# EAGLE design StabTracker (EAGLE 7.5.0)

## Sheet 1 of 3
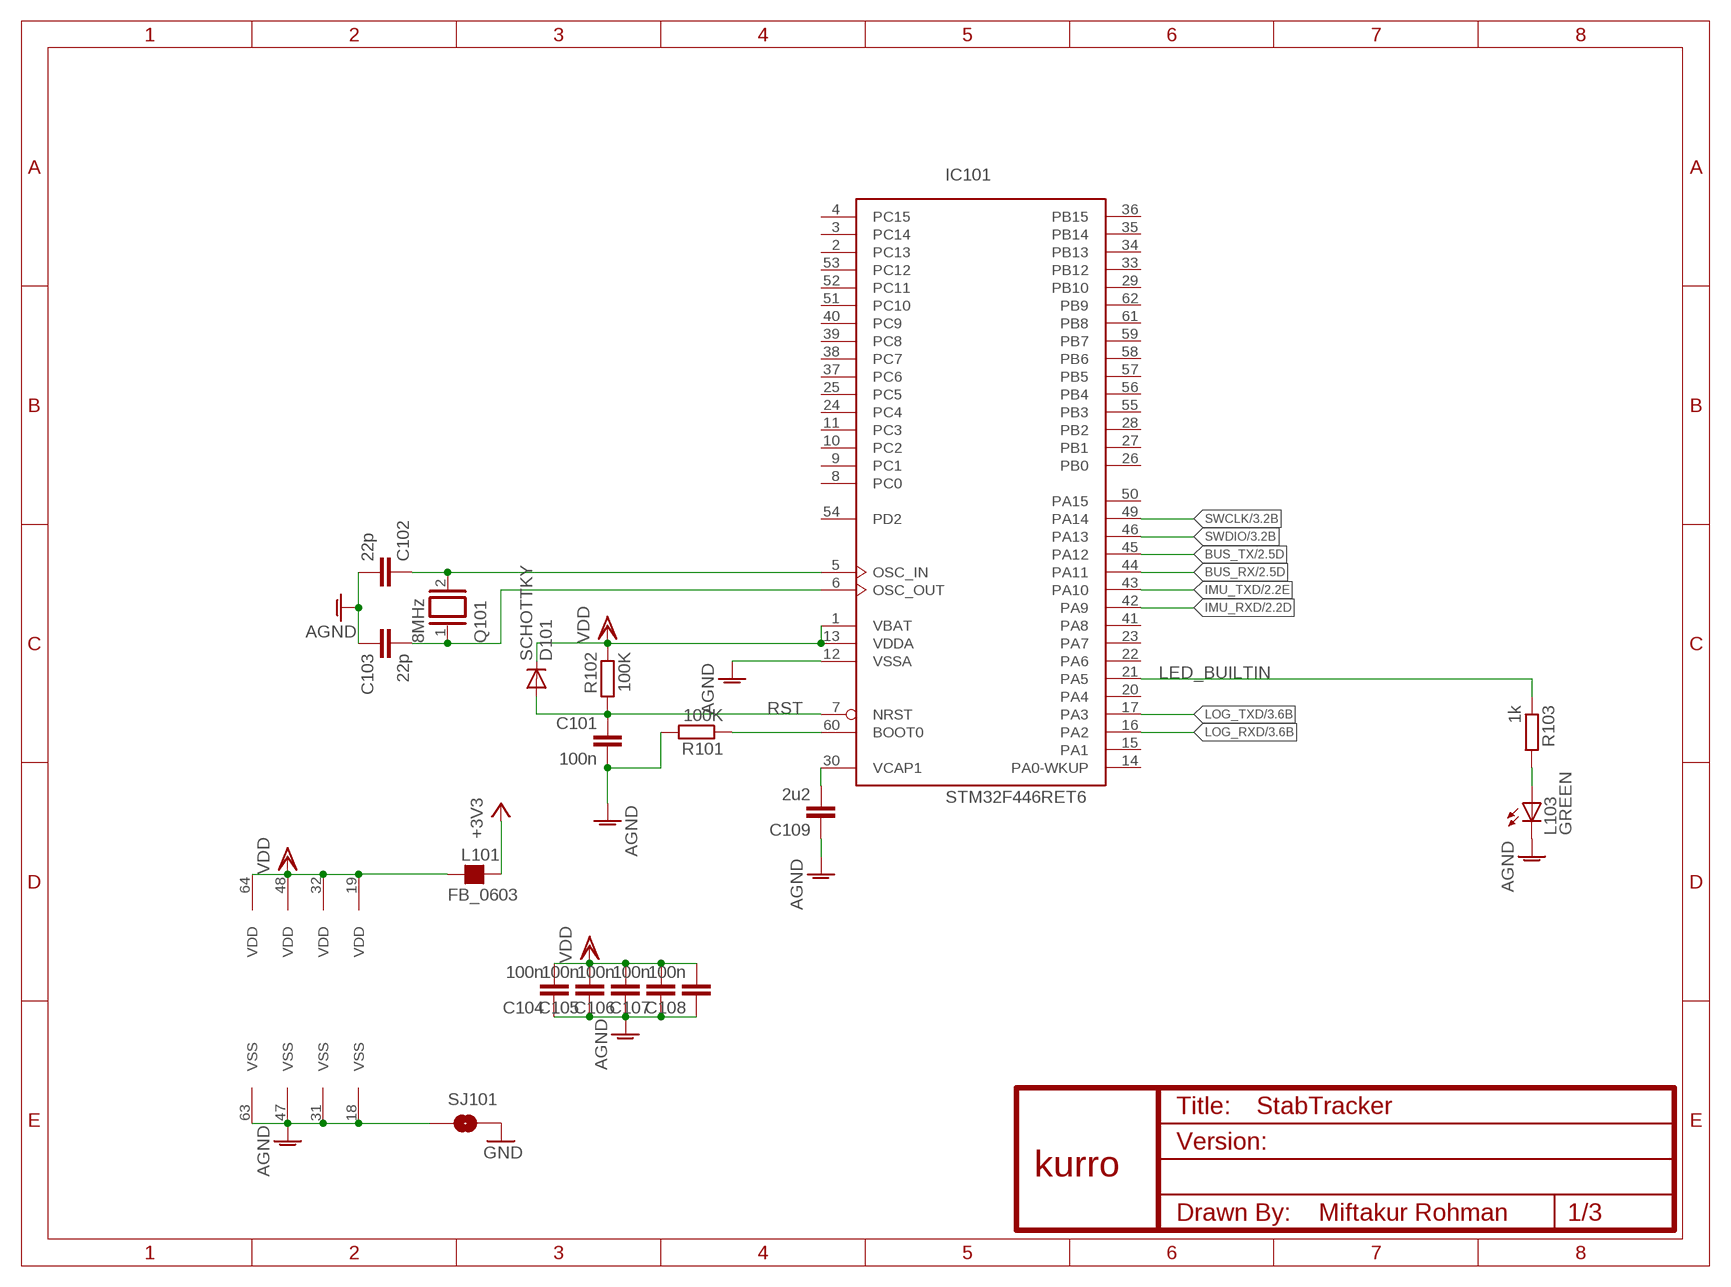
[diagram p0: schematic, sheet 1]

### Parts
C101  100n  C-EUC0603  [C0603]
C102  22p  C-EUC0603  [C0603]
C103  22p  C-EUC0603  [C0603]
C104  100n  C-EUC0603  [C0603]
C105  100n  C-EUC0603  [C0603]
C106  100n  C-EUC0603  [C0603]
C107  100n  C-EUC0603  [C0603]
C108  100n  C-EUC0603  [C0603]
C109  2u2  C-EUC0603  [C0603]
D101  SCHOTTKY  DIODE-MICROMELF-W  [MICROMELF-W]
IC101  STM32F446RET6  STM32F401RBT  [LQFP64]
L101  FB_0603  [L0603]
L103  GREEN  LEDCHIP-LED0805  [CHIP-LED0805]
Q101  8MHz  XTAL/S  [QS]
R101  100K  R-EU_R0603  [R0603]
R102  100K  R-EU_R0603  [R0603]
R103  1k  R-EU_R0603  [R0603]
SJ101  SOLDERJUMPERTRACE  [SJ_2S-TRACE]
U$1  KURRO_FOOTPRINT  [KURRO-LOGO]

### Nets
+3V3: L101.2 ; also sheet 2,3
AGND: C101.2 C102.2 C103.1 C104.1 C105.1 C106.1 C107.1 C108.1 C109.1 IC101.12(VSSA) IC101.18(VSS) IC101.31(VSS) IC101.47(VSS) IC101.63(VSS) L103.C R101.2 SJ101.1 ; also sheet 3
BOOT0: IC101.60(BOOT0) R101.1
BUS_RX: IC101.44(PA11) ; also sheet 2
BUS_TX: IC101.45(PA12) ; also sheet 2
GND: SJ101.2 ; also sheet 2,3
IMU_RXD: IC101.42(PA9) ; also sheet 2
IMU_TXD: IC101.43(PA10) ; also sheet 2
LED_BUILTIN: IC101.21(PA5) R103.1
LOG_RXD: IC101.16(PA2) ; also sheet 3
LOG_TXD: IC101.17(PA3) ; also sheet 3
N$1: C103.2 IC101.6(OSC_OUT) Q101.1
N$2: C102.1 IC101.5(OSC_IN) Q101.2
N$4: C109.2 IC101.30(VCAP1)
N$5: L103.A R103.2
RST: C101.1 D101.A IC101.7(NRST) R102.2
SWCLK: IC101.49(PA14) ; also sheet 3
SWDIO: IC101.46(PA13) ; also sheet 3
VDD: C104.2 C105.2 C106.2 C107.2 C108.2 D101.C IC101.1(VBAT) IC101.13(VDDA) IC101.19(VDD) IC101.32(VDD) IC101.48(VDD) IC101.64(VDD) L101.1 R102.1
Unconnected: IC101.2(PC13) IC101.3(PC14) IC101.4(PC15) IC101.8(PC0) IC101.9(PC1) IC101.10(PC2) IC101.11(PC3) IC101.14(PA0-WKUP) IC101.15(PA1) IC101.20(PA4) IC101.22(PA6) IC101.23(PA7) IC101.24(PC4) IC101.25(PC5) IC101.26(PB0) IC101.27(PB1) IC101.28(PB2) IC101.29(PB10) IC101.33(PB12) IC101.34(PB13) IC101.35(PB14) IC101.36(PB15) IC101.37(PC6) IC101.38(PC7) IC101.39(PC8) IC101.40(PC9) IC101.41(PA8) IC101.50(PA15) IC101.51(PC10) IC101.52(PC11) IC101.53(PC12) IC101.54(PD2) IC101.55(PB3) IC101.56(PB4) IC101.57(PB5) IC101.58(PB6) IC101.59(PB7) IC101.61(PB8) IC101.62(PB9)

## Sheet 2 of 3
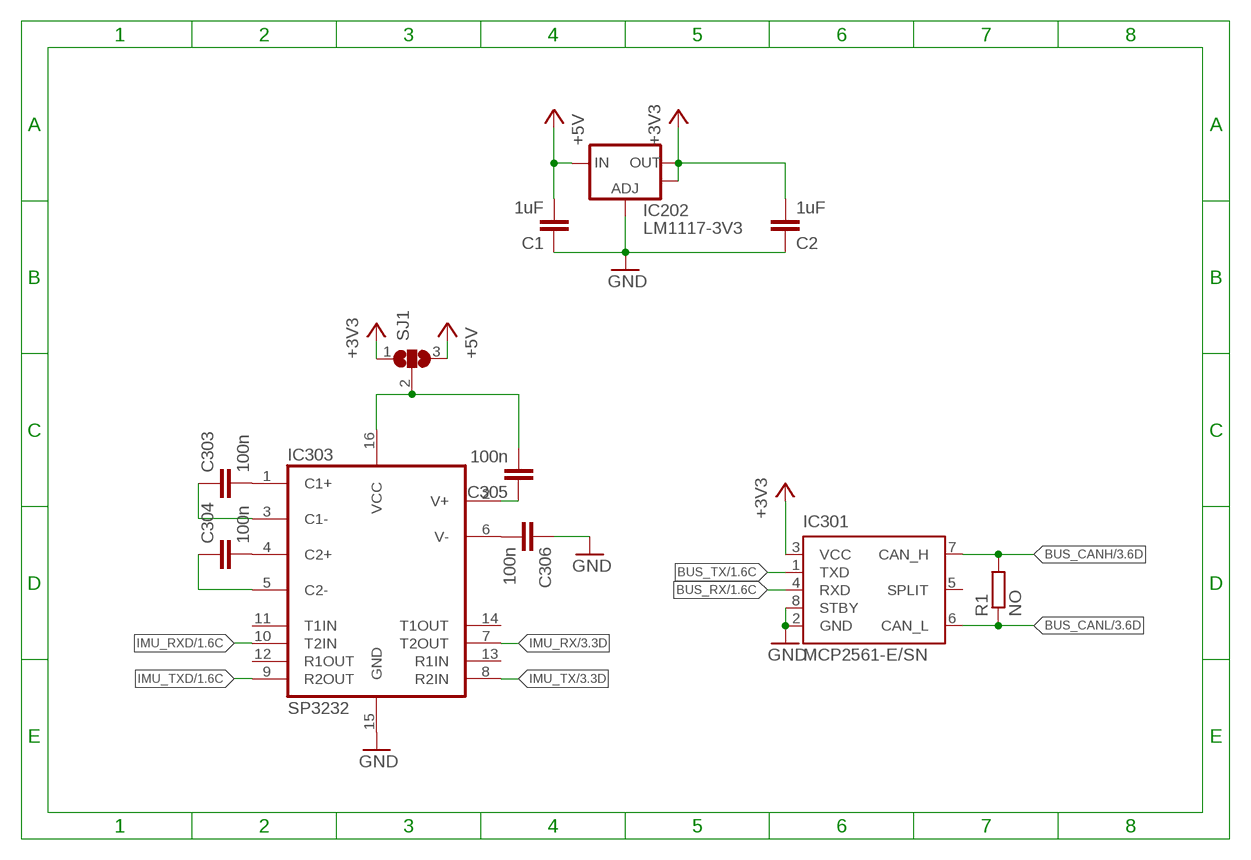
[diagram p1: schematic, sheet 2]

### Parts
C1  1uF  C-EUC0603  [C0603]
C2  1uF  C-EUC0603  [C0603]
C303  100n  C-EUC0603  [C0603]
C304  100n  C-EUC0603  [C0603]
C305  100n  C-EUC0603  [C0603]
C306  100n  C-EUC0603  [C0603]
IC202  LM1117-3V3  V_REG_LM1117SOT223  [SOT223]
IC301  MCP2561-E/SN  [SOIC-8]
IC303  SP3232  MAX232SOIC16  [SO016]
R1  NO  R-EU_R0603  [R0603]
SJ1  SJ2W-TRACE  [SJ2]

### Nets
+3V3: C2.2 IC202.2(OUT) IC202.4(OUT) IC301.3(VCC) SJ1.1 ; also sheet 1,3
+5V: C1.2 IC202.3(IN) SJ1.3 ; also sheet 3
BUS_CANH: IC301.7(CAN_H) R1.2 ; also sheet 3
BUS_CANL: IC301.6(CAN_L) R1.1 ; also sheet 3
BUS_RX: IC301.4(RXD) ; also sheet 1
BUS_TX: IC301.1(TXD) ; also sheet 1
GND: C1.1 C2.1 C306.1 IC202.1(ADJ) IC301.2(GND) IC301.8(STBY) IC303.15(GND) ; also sheet 1,3
IMU_RX: IC303.7(T2OUT) ; also sheet 3
IMU_RXD: IC303.10(T2IN) ; also sheet 1
IMU_TX: IC303.8(R2IN) ; also sheet 3
IMU_TXD: IC303.9(R2OUT) ; also sheet 1
N$7: C305.2 IC303.16(VCC) SJ1.2
N$31: C306.2 IC303.6(V-)
N$32: C303.2 IC303.1(C1+)
N$33: C304.2 IC303.4(C2+)
N$68: C303.1 IC303.3(C1-)
N$69: C304.1 IC303.5(C2-)
N$72: C305.1 IC303.2(V+)
Unconnected: IC301.5(SPLIT) IC303.11(T1IN) IC303.12(R1OUT) IC303.13(R1IN) IC303.14(T1OUT)

## Sheet 3 of 3
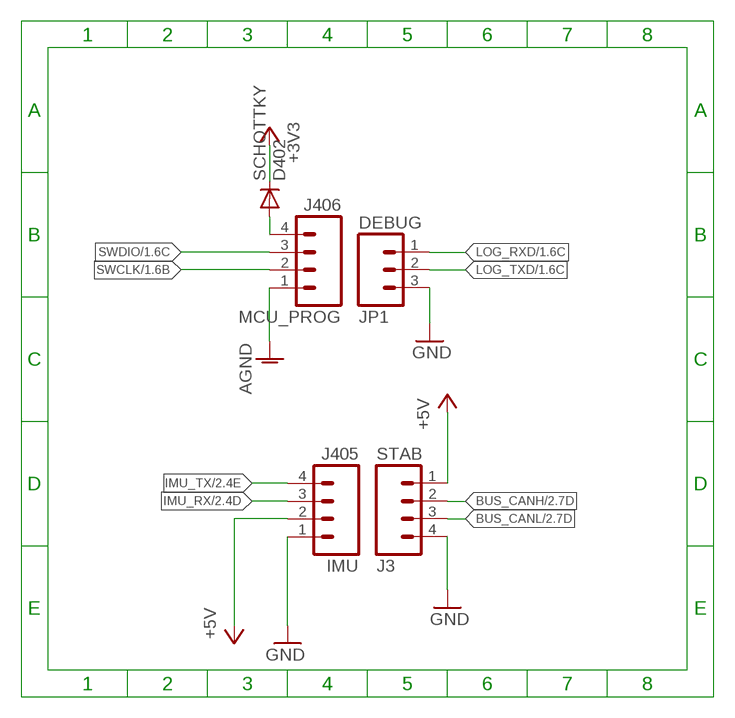
[diagram p2: schematic, sheet 3]

### Parts
D402  SCHOTTKY  DIODE-MICROMELF-W  [MICROMELF-W]
J3  STAB  M04-XH-RA  [XH-4-RA]
J405  IMU  M04-XH-RA  [XH-4-RA]
J406  MCU_PROG  M04-XH-RA  [XH-4-RA]
JP1  DEBUG  M03-XH-RA  [XH-3-RA]

### Nets
+3V3: D402.C ; also sheet 1,2
+5V: J3.1 J405.2 ; also sheet 2
AGND: J406.1 ; also sheet 1
BUS_CANH: J3.2 ; also sheet 2
BUS_CANL: J3.3 ; also sheet 2
GND: J3.4 J405.1 JP1.3 ; also sheet 1,2
IMU_RX: J405.3 ; also sheet 2
IMU_TX: J405.4 ; also sheet 2
LOG_RXD: JP1.1 ; also sheet 1
LOG_TXD: JP1.2 ; also sheet 1
N$3: D402.A J406.4
SWCLK: J406.2 ; also sheet 1
SWDIO: J406.3 ; also sheet 1

## Library data of the parts
C1 C2 C101-C109 C303-C306 = resistor:C-EU: CAPACITOR, European symbol
D101 D402 = diode:DIODE-: DIODE
IC101 = micro-stm_v3:STM32F401R*T: ARM 32-bit Cortex™-M3 CPU 84 MHz maximum frequency 128 to 256 Kbytes of Flash memory 64 kbytes of SRAM 50 GPIOs 1.7 to 3.6 V application supply
IC202 = SparkFun:V_REG_LM1117: Voltage Regulator LM1117 Standard adjustable voltage regulator but in SMD form. Spark Fun Electronics SKU : COM-00595
IC301 = microchip:MCP256*
IC303 = SparkFun-DigitalIC:MAX232: RS232 Transceiver Very common IC. This is generically called 'MAX232', but works with the 3V equivalent MAX3232 generic ICs. Field tested and mother approved. Spark Fun Electronics SKU : COM-00316 (DIP) and COM-00589 (SMD); PROD_ID: IC-08171
J3 J405 J406 = SparkFun-Connectors:M04: Header 4 Standard 4-pin 0.1" header. Use with straight break away headers (SKU : PRT-00116), right angle break away headers (PRT-00553), swiss pins (PRT-00743), machine pins (PRT-00117), and female headers (PRT-00115). Molex polarized connector foot print use with SKU : PRT-08231 with associated crimp pins and housings. 1MM SMD Version SKU: PRT-10208
JP1 = SparkFun-Connectors:M03: Header 3 Standard 3-pin 0.1" header. Use with straight break away headers (SKU : PRT-00116), right angle break away headers (PRT-00553), swiss pins (PRT-00743), machine pins (PRT-00117), and female headers (PRT-00115). Molex polarized connector foot print use with SKU : PRT-08232 with associated crimp pins and housings.
L101 = rc-master:FB_: FERRITE BEAD
L103 = led:LED: LED OSRAM: - CHIPLED LG R971, LG N971, LY N971, LG Q971, LY Q971, LO R971, LY R971 LH N974, LH R974 LS Q976, LO Q976, LY Q976 LO Q996 - Hyper CHIPLED LW Q18S LB Q993, LB Q99A, LB R99A - SideLED LS A670, LO A670, LY A670, LG A670, LP A670 LB A673, LV A673, LT A673, LW A673 LH A674 LY A675 LS A676, LA A676, LO A676, LY A676, LW A676 LS A679, LY A679, LG A679 - Hyper Micro SIDELED® LS Y876, LA Y876, LO Y876, LY Y876 LT Y87S - SmartLED LW L88C, LW L88S LB L89C, LB L89S, LG L890 LS L89K, LO L89K, LY L89K LS L896, LA L896, LO L896, LY L896 - TOPLED LS T670, LO T670, LY T670, LG T670, LP T670 LSG T670, LSP T670, LSY T670, LOP T670, LYG T670 LG T671, LOG T671, LSG T671 LB T673, LV T673, LT T673, LW T673 LH T674 LS T676, LA T676, LO T676, LY T676, LB T676, LH T676, LSB T676, LW T676 LB T67C, LV T67C, LT T67C, LS T67K, LO T67K, LY T67K, LW E67C LS E67B, LA E67B, LO E67B, LY E67B, LB E67C, LV E67C, LT E67C LW T67C LS T679, LY T679, LG T679 LS T770, LO T770, LY T770, LG T770, LP T770 LB T773, LV T773, LT T773, LW T773 LH T774 LS E675, LA E675, LY E675, LS T675 LS T776, LA T776, LO T776, LY T776, LB T776 LHGB T686 LT T68C, LB T68C - Hyper Mini TOPLED® LB M676 - Mini TOPLED Santana® LG M470 LS M47K, LO M47K, LY M47K Source: http://www.osram.convergy.de LUXEON: - LUMILED® LXK2-PW12-R00, LXK2-PW12-S00, LXK2-PW14-U00, LXK2-PW14-V00 LXK2-PM12-R00, LXK2-PM12-S00, LXK2-PM14-U00 LXK2-PE12-Q00, LXK2-PE12-R00, LXK2-PE12-S00, LXK2-PE14-T00, LXK2-PE14-U00 LXK2-PB12-K00, LXK2-PB12-L00, LXK2-PB12-M00, LXK2-PB14-N00, LXK2-PB14-P00, LXK2-PB14-Q00 LXK2-PR12-L00, LXK2-PR12-M00, LXK2-PR14-Q00, LXK2-PR14-R00 LXK2-PD12-Q00, LXK2-PD12-R00, LXK2-PD12-S00 LXK2-PH12-R00, LXK2-PH12-S00 LXK2-PL12-P00, LXK2-PL12-Q00, LXK2-PL12-R00 Source: www.luxeon.com KINGBRIGHT: KA-3528ASYC Source: www.kingbright.com
Q101 = special:XTAL/S: CRYSTAL
R1 R101-R103 = resistor:R-EU_: RESISTOR, European symbol
SJ1 = jumper:SJ2W: SMD solder JUMPER
SJ101 = SparkFun:SOLDERJUMPER: Solder Jumper Standard SMD solder jumper. Used to automate production. Two varients : Normally Open and Normally Closed are the same, but have different paste layers. NC will have a large amount of paste and should jumper during reflow.; BOM: EXCLUDE; DNP: T
U$1 = SparkFun:KURRO_FOOTPRINT

## Net classes
0 default: width 0.203 mm, drill 0.5 mm, clearance 0.203 mm

## Board
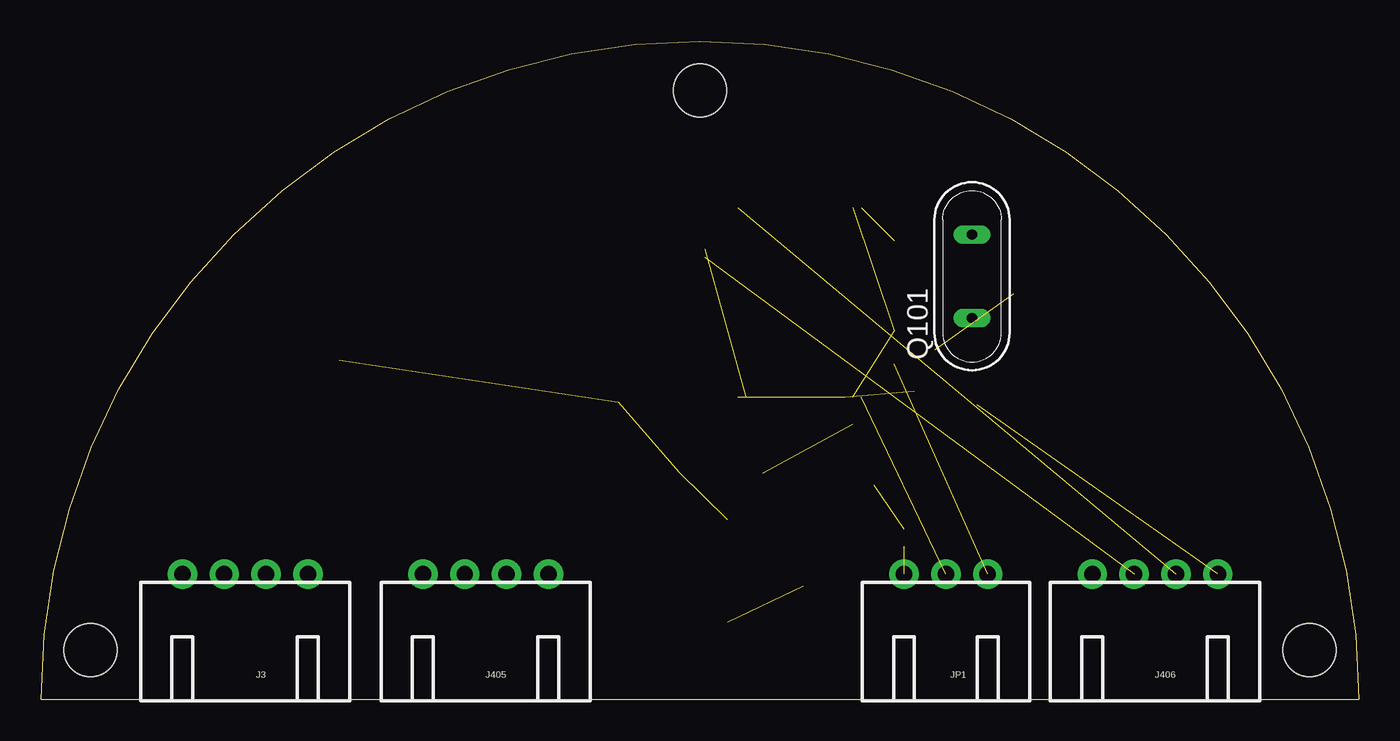
[diagram p3: board, top side]
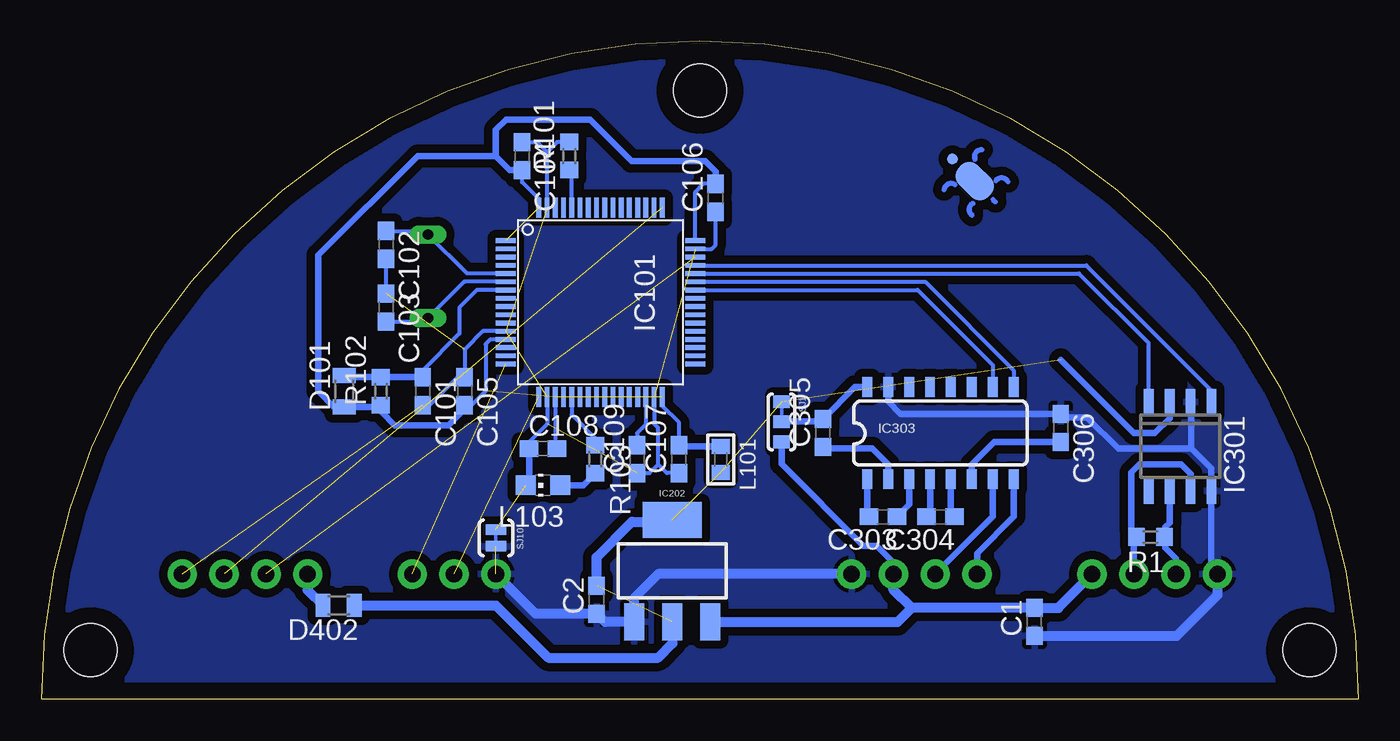
[diagram p4: board, bottom side, seen from below]

Size 80 x 40 mm. Coordinates in mm from the lower left corner, seen from the top.
Outline: 0,0 80,0 arc180 0,0
Copper layers (1*16): Top 0.035mm / dielectric 1.5mm / Bottom 0.035mm
Design rules "default": minimum track width 10mil, minimum drill 24mil, track to track 8mil, track to pad 8mil, pad to pad 8mil, via to via 8mil, smd to smd 8mil, copper to edge 40mil, drill to drill 8mil, minimum pad ring 10mil, minimum via ring 8mil, stop-mask expansion 4mil, vias tented up to drill 0mil, thermal gap 10mil
Holes 3.2 mm at 3,3 77,3 40,37

### Footprints (pad centres in the part's own frame; a part is rotated, then mirrored left to right if it is on the bottom)
C0603 = smd 1.1 x 1: 1 -0.85,0; 2 0.85,0
MICROMELF-W = smd 0.9 x 1.4: A 0.95,0; C -0.95,0
LQFP64 = smd 0.29 x 1.2: 1 -3.75,-5.75; 2 -3.25,-5.75; 3 -2.75,-5.75; 4 -2.25,-5.75; 5 -1.75,-5.75; 6 -1.25,-5.75; 7 -0.75,-5.75; 8 -0.25,-5.75; 9 0.25,-5.75; 10 0.75,-5.75; 11 1.25,-5.75; 12 1.75,-5.75; 13 2.25,-5.75; 14 2.75,-5.75; 15 3.25,-5.75; 16 3.75,-5.75; 33 3.75,5.75; 34 3.25,5.75; 35 2.75,5.75; 36 2.25,5.75; 37 1.75,5.75; 38 1.25,5.75; 39 0.75,5.75; 40 0.25,5.75; 41 -0.25,5.75; 42 -0.75,5.75; 43 -1.25,5.75; 44 -1.75,5.75; 45 -2.25,5.75; 46 -2.75,5.75; 47 -3.25,5.75; 48 -3.75,5.75 | smd 1.2 x 0.29: 17 5.75,-3.75; 18 5.75,-3.25; 19 5.75,-2.75; 20 5.75,-2.25; 21 5.75,-1.75; 22 5.75,-1.25; 23 5.75,-0.75; 24 5.75,-0.25; 25 5.75,0.25; 26 5.75,0.75; 27 5.75,1.25; 28 5.75,1.75; 29 5.75,2.25; 30 5.75,2.75; 31 5.75,3.25; 32 5.75,3.75; 49 -5.75,3.75; 50 -5.75,3.25; 51 -5.75,2.75; 52 -5.75,2.25; 53 -5.75,1.75; 54 -5.75,1.25; 55 -5.75,0.75; 56 -5.75,0.25; 57 -5.75,-0.25; 58 -5.75,-0.75; 59 -5.75,-1.25; 60 -5.75,-1.75; 61 -5.75,-2.25; 62 -5.75,-2.75; 63 -5.75,-3.25; 64 -5.75,-3.75
SOT223 = smd 1.219 x 2.235: 1 -2.311,-3.099; 2 0,-3.099; 3 2.311,-3.099 | smd 3.6 x 2.2: 4 0,3.099
SOIC-8 = smd 0.6 x 1.6: 1 -1.905,-2.7; 2 -0.635,-2.7; 3 0.635,-2.7; 4 1.905,-2.7; 5 1.905,2.7; 6 0.635,2.7; 7 -0.635,2.7; 8 -1.905,2.7
SO016 = smd 0.6 x 1.2: 1 -4.445,-2.8; 2 -3.175,-2.8; 3 -1.905,-2.8; 4 -0.635,-2.8; 5 0.635,-2.8; 6 1.905,-2.8; 7 3.175,-2.8; 8 4.445,-2.8; 9 4.445,2.8; 10 3.175,2.8; 11 1.905,2.8; 12 0.635,2.8; 13 -0.635,2.8; 14 -1.905,2.8; 15 -3.175,2.8; 16 -4.445,2.8
XH-4-RA = drill 1 pad 1.778: 1 -3.81,0; 2 -1.27,0; 3 1.27,0; 4 3.81,0
XH-3-RA = drill 1 pad 1.778: 1 -2.54,0; 2 0,0; 3 2.54,0
L0603 = smd 0.9 x 1.1: 1 -0.794,0; 2 0.794,0
CHIP-LED0805 = smd 1.2 x 1.2: A 0,-1.05; C 0,1.05
QS = drill 0.61 long: 1 -2.54,0; 2 2.54,0
R0603 = smd 1 x 1.1: 1 -0.85,0; 2 0.85,0
SJ2 = smd 0.762 x 1.016: 1 -1.235,0; 2 -0.035,0; 3 1.203,0
SJ_2S-TRACE = smd 0.635 x 1.27: 1 -0.508,0; 2 0.508,0
KURRO-LOGO = smd 2.54 x 1.651 rotated 45 bottom: P$1 0,0 | smd 0.635 x 0.635 rotated 45 bottom: P$2 1.347,1.347

### Placement (x,y rotation side)
C1  19.69,4.72 90 bottom
C2  46.28,6.07 90 bottom
C101  56.83,18.73 270 bottom
C102  59.05,27.62 270 bottom
C103  59.05,23.81 270 bottom
C104  50.8,33.02 270 bottom
C105  54.29,18.73 270 bottom
C106  39.05,30.48 90 bottom
C107  41.27,14.61 90 bottom
C108  49.53,15.24 0 bottom
C109  43.81,14.61 90 bottom
C303  28.89,11.11 180 bottom
C304  25.4,11.11 180 bottom
C305  32.53,16.2 90 bottom
C306  18.1,16.51 270 bottom
D101  61.59,18.73 90 bottom
D402  61.94,5.71 180 bottom
IC101  46.04,24.13 270 bottom
IC202  41.68,7.82 0 bottom
IC301  10.85,15.38 180 bottom
IC303  25.4,16.19 0 bottom
J3  12.38,7.62 180 top
J405  26.99,7.62 180 top
J406  67.63,7.62 180 top
JP1  54.93,7.62 180 top
L101  38.73,14.58 270 bottom
L103  49.53,13.02 90 bottom
Q101  56.52,25.72 90 top
R1  12.66,9.87 180 bottom
R101  47.94,33.02 90 bottom
R102  59.37,18.73 90 bottom
R103  46.35,14.61 270 bottom
SJ1  35.05,16.85 270 bottom
SJ101  52.39,9.82 270 bottom
U$1  23.32,31.5 0 top

### Tracks (layer width: path | path; a pad name or v marks a point on that pad's centre or on a via)
+3V3  (4 unrouted)
  Bottom 0.406: IC301.3 11.49,17.09 12.38,16.19 13.65,16.19 18.1,20.64
  Bottom 0.61: D402.C 52.39,5.71 49.21,2.54 42.55,2.54 41.68,3.4 IC202.2 | C2.2 46.28,8.65 44.13,10.79 41.8,10.79 IC202.4
+5V
  Bottom 0.406: J405.2 28.26,8.34 29.26,9.35 30.07,9.35 35.05,14.32 SJ1.3
  Bottom 0.61: J3.1 18.25,5.57 C1.2 27.16,5.57 | 27.16,5.57 28.26,6.67 J405.2 | IC202.3 28.01,4.72 27.16,5.57
AGND  (7 unrouted)
  Bottom 0.254: C103.1 C102.2 | C109.1 43.08,13.76 42.55,14.29 | 42.55,14.29 42.55,16.51 42.79,16.75 IC101.31 | IC101.18 49.29,16.75 50.38,15.66 C108.1 | IC101.12 53.19,22.38 54.29,21.27 C105.1 54.71,19.58 56.41,17.88 C101.2 | IC101.63 49.29,33.26 | 49.29,33.26 48.68,33.87 R101.2 | C104.1 49.9,33.87 49.29,33.26 | IC101.47 39.3,27.38 39.05,27.62 C106.1 | C107.1 42.01,13.76 42.55,14.29
  Bottom 0.406: C108.1 50.38,13.22 L103.C
BOOT0
  Bottom 0.254: IC101.60 47.79,32.02 R101.1
BUS_CANH
  Bottom 0.406: J3.2 13.65,9.73 R1.2 13.51,10.02 13.81,10.32 13.81,13.81 13.34,14.29 10.79,14.29 10.22,13.71 IC301.7
BUS_CANL
  Bottom 0.406: IC301.6 11.49,10.74 11.75,10.48 11.75,9.94 R1.1 11.75,9.81 11.75,9.21 11.11,8.57 J3.3
BUS_RX
  Bottom 0.254: IC101.44 16.99,25.88 12.76,21.65 IC301.4
BUS_TX
  Bottom 0.254: IC101.45 16.54,26.38 8.95,18.79 IC301.1
GND  (1 unrouted)
  Bottom 0.406: IC303.15 28.57,18.1 27.84,17.36 C306.1 17.88,17.14 16.51,17.14 14.61,15.24 10.16,15.24 | J3.4 8.95,8 IC301.8 8.95,14.03 10.16,15.24 | 10.16,15.24 10.16,18.02 IC301.2
  Bottom 0.61: C1.1 11.05,3.87 8.57,6.35 J3.4 | J405.1 42.55,7.62 43.99,6.17 IC202.1 45.78,4.72 C2.1 49.98,5.22 JP1.3
  pour Bottom (isolate 0.508, rank 6): 0,0 80,0 80,40 0,40
IMU_RX
  Bottom 0.406: IC303.7 22.23,11.11 J405.3
IMU_RXD
  Bottom 0.254: IC101.42 26.79,24.88 22.23,20.32 IC303.10
IMU_TX
  Bottom 0.406: IC303.8 20.95,11.11 23.18,8.89 J405.4
IMU_TXD
  Bottom 0.254: IC101.43 26.33,25.38 20.95,20 IC303.9
LED_BUILTIN
  Bottom 0.254: IC101.21 47.79,17.31 46.35,15.88 R103.1
LOG_RXD  (1 unrouted)
LOG_TXD  (1 unrouted)
N$1
  Bottom 0.254: IC101.6 54.31,25.38 Q101.1 56.73,22.96 C103.2
N$2
  Bottom 0.254: IC101.5 54.14,25.88 Q101.2 56.73,28.47 C102.1
N$3
  Bottom 0.61: J406.4 63.82,6.65 D402.A
N$4
  Bottom 0.254: IC101.30 43.29,16.72 43.81,16.19 C109.2
N$5
  Bottom 0.406: L103.A 47.09,13.02 R103.2
N$7
  Bottom 0.406: IC303.16 30.59,18.99 C305.2 32.7,16.89 SJ1.2
N$31
  Bottom 0.406: IC303.6 23.5,14.29 22.12,15.66 C306.2
N$32
  Bottom 0.406: IC303.1 29.84,11.21 C303.2
N$33
  Bottom 0.406: IC303.4 26.04,11.33 C304.2
N$68
  Bottom 0.406: IC303.3 27.3,11.85 C303.1
N$69
  Bottom 0.406: IC303.5 24.77,11.33 C304.1
N$72
  Bottom 0.406: IC303.2 28.57,14.29 29.53,15.24 32.41,15.24 C305.1
RST
  Bottom 0.254: IC101.7 53.54,24.88 54.61,23.81 54.61,22.23 56.83,20 C101.1
  Bottom 0.406: C101.1 R102.2 61.49,19.58 D101.A
SWCLK  (1 unrouted)
SWDIO  (1 unrouted)
VDD  (3 unrouted)
  Bottom 0.254: C107.2 41.27,16.83 42.29,17.84 IC101.32 | IC101.19 48.79,15.35 C108.2 | IC101.13 52.73,21.88 53.02,21.59 53.02,18.73 53.87,17.88 C105.2 | IC101.64 49.79,30.42 50.8,31.43 C104.2 | IC101.48 40.29,30.83 39.79,31.33 C106.2
  Bottom 0.406: L101.1 41.2,15.38 C107.2 | C105.2 54.29,17.64 55.27,16.66 58.52,16.66 59.33,17.48 59.33,17.84 R102.1 59.47,17.78 D101.C 62.23,17.78 63.18,18.73 63.18,26.99 57.15,33.02 52.39,33.02 | C106.2 39.05,32.07 39.69,32.7 44.13,32.7 46.67,35.24 51.75,35.24 52.39,34.61 52.39,33.02 | 52.39,33.02 51.54,32.17 C104.2